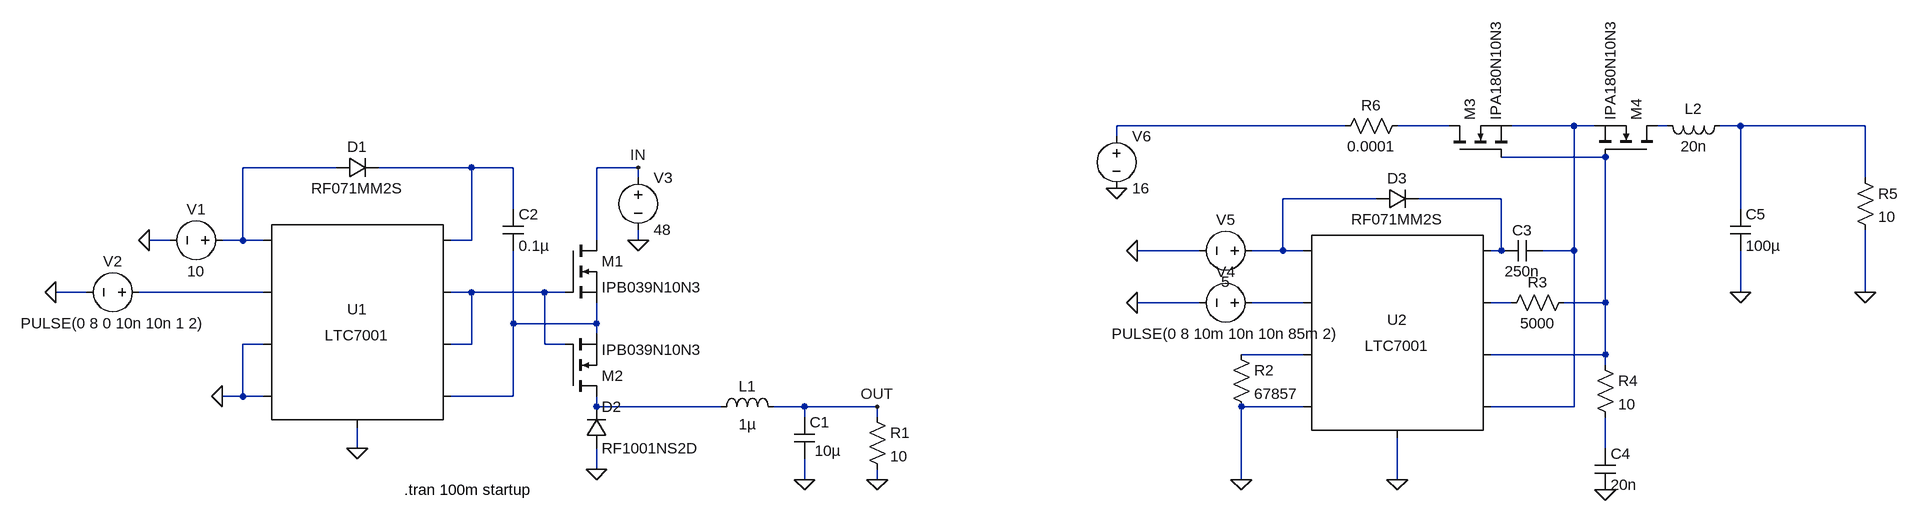
[diagram p0: schematic LTC7001 TEST.asc]
LTC7001 TEST.asc, the LTspice schematic file:
Version 4.1
SHEET 1 3940 1256
WIRE 2672 -352 2320 -352
WIRE 2832 -352 2752 -352
WIRE 3024 -352 2928 -352
WIRE 3056 -352 3024 -352
WIRE 3168 -352 3152 -352
WIRE 3280 -352 3248 -352
WIRE 3472 -352 3280 -352
WIRE 2320 -336 2320 -352
WIRE 3072 -304 2912 -304
WIRE 1120 -288 976 -288
WIRE 1328 -288 1184 -288
WIRE 1392 -288 1328 -288
WIRE 1584 -288 1520 -288
WIRE 1584 -272 1584 -288
WIRE 3472 -272 3472 -352
WIRE 2720 -240 2576 -240
WIRE 2912 -240 2784 -240
WIRE 1392 -224 1392 -288
WIRE 3280 -224 3280 -352
WIRE 864 -176 832 -176
WIRE 976 -176 976 -288
WIRE 976 -176 944 -176
WIRE 1008 -176 976 -176
WIRE 1328 -176 1328 -288
WIRE 1328 -176 1296 -176
WIRE 1520 -176 1520 -288
WIRE 1584 -176 1584 -192
WIRE 2448 -160 2352 -160
WIRE 2576 -160 2576 -240
WIRE 2576 -160 2528 -160
WIRE 2608 -160 2576 -160
WIRE 2912 -160 2912 -240
WIRE 2912 -160 2896 -160
WIRE 3024 -160 3024 -352
WIRE 3024 -160 2976 -160
WIRE 736 -96 688 -96
WIRE 1008 -96 816 -96
WIRE 1328 -96 1296 -96
WIRE 1440 -96 1328 -96
WIRE 1472 -96 1440 -96
WIRE 3280 -96 3280 -160
WIRE 3472 -96 3472 -192
WIRE 2448 -80 2352 -80
WIRE 2608 -80 2528 -80
WIRE 2928 -80 2896 -80
WIRE 3072 -80 3072 -304
WIRE 3072 -80 3008 -80
WIRE 1392 -48 1392 -160
WIRE 1520 -48 1520 -80
WIRE 1520 -48 1392 -48
WIRE 1520 -32 1520 -48
WIRE 1008 -16 976 -16
WIRE 1328 -16 1328 -96
WIRE 1328 -16 1296 -16
WIRE 1440 -16 1440 -96
WIRE 1472 -16 1440 -16
WIRE 2608 0 2512 0
WIRE 3072 0 3072 -80
WIRE 3072 0 2896 0
WIRE 3072 16 3072 0
WIRE 976 64 976 -16
WIRE 976 64 944 64
WIRE 1008 64 976 64
WIRE 1392 64 1392 -48
WIRE 1392 64 1296 64
WIRE 1520 80 1520 64
WIRE 1712 80 1520 80
WIRE 1840 80 1792 80
WIRE 1952 80 1840 80
WIRE 2608 80 2512 80
WIRE 3024 80 3024 -160
WIRE 3024 80 2896 80
WIRE 1840 96 1840 80
WIRE 1952 96 1952 80
WIRE 1152 144 1152 112
WIRE 3072 144 3072 96
WIRE 1520 176 1520 144
WIRE 1840 192 1840 160
WIRE 1952 192 1952 176
WIRE 2512 192 2512 80
WIRE 2752 192 2752 128
FLAG 944 64 0
FLAG 832 -176 0
FLAG 688 -96 0
FLAG 1584 -176 0
FLAG 1840 192 0
FLAG 1952 192 0
FLAG 1952 80 OUT
FLAG 1520 176 0
FLAG 1152 144 0
FLAG 1584 -288 IN
FLAG 2752 192 0
FLAG 2512 192 0
FLAG 2352 -160 0
FLAG 2352 -80 0
FLAG 3280 -96 0
FLAG 3472 -96 0
FLAG 2320 -256 0
FLAG 3072 208 0
SYMBOL voltage 960 -176 R90
WINDOW 0 -32 56 VBottom 2
WINDOW 3 32 56 VTop 2
SYMATTR InstName V1
SYMATTR Value 10
SYMBOL voltage 832 -96 R90
WINDOW 123 74 56 VTop 2
WINDOW 39 53 56 VTop 2
WINDOW 0 -32 56 VBottom 2
WINDOW 3 32 56 VTop 2
SYMATTR InstName V2
SYMATTR Value PULSE(0 8 0 10n 10n 1 2)
SYMBOL diode 1120 -272 R270
WINDOW 0 32 32 VTop 2
WINDOW 3 0 32 VBottom 2
SYMATTR InstName D1
SYMATTR Value RF071MM2S
SYMBOL nmos 1472 -176 R0
SYMATTR InstName M1
SYMATTR Value IPB039N10N3
SYMBOL ind 1696 96 R270
WINDOW 0 32 56 VTop 2
WINDOW 3 5 56 VBottom 2
SYMATTR InstName L1
SYMATTR Value 1µ
SYMATTR SpiceLine Rser=3m
SYMBOL cap 1824 96 R0
WINDOW 3 32 52 Left 2
SYMATTR Value 10µ
SYMATTR SpiceLine Rser=7m
SYMATTR InstName C1
SYMBOL res 1936 80 R0
SYMATTR InstName R1
SYMATTR Value 10
SYMBOL voltage 1584 -288 R0
SYMATTR InstName V3
SYMATTR Value 48
SYMBOL cap 1376 -224 R0
SYMATTR InstName C2
SYMATTR Value 0.1µ
SYMBOL diode 1504 144 M180
WINDOW 0 24 64 Left 2
WINDOW 3 24 0 Left 2
SYMATTR InstName D2
SYMATTR Value RF1001NS2D
SYMBOL LTC7001 1152 -48 R0
SYMATTR InstName U1
SYMBOL nmos 1472 64 M180
SYMATTR InstName M2
SYMATTR Value IPB039N10N3
SYMBOL PowerProducts\\LTC7001 2752 -32 R0
SYMATTR InstName U2
SYMBOL res 2496 -16 R0
SYMATTR InstName R2
SYMATTR Value 67857
SYMBOL cap 2976 -176 R90
WINDOW 0 0 32 VBottom 2
WINDOW 3 32 32 VTop 2
SYMATTR InstName C3
SYMATTR Value 250n
SYMBOL nmos 2832 -304 R270
SYMATTR InstName M3
SYMATTR Value IPA180N10N3
SYMBOL nmos 3152 -304 M270
SYMATTR InstName M4
SYMATTR Value IPA180N10N3
SYMBOL diode 2720 -224 R270
WINDOW 0 32 32 VTop 2
WINDOW 3 0 32 VBottom 2
SYMATTR InstName D3
SYMATTR Value RF071MM2S
SYMBOL voltage 2544 -80 R90
WINDOW 123 74 56 VTop 2
WINDOW 39 53 56 VTop 2
WINDOW 0 -32 56 VBottom 2
WINDOW 3 32 56 VTop 2
SYMATTR InstName V4
SYMATTR Value PULSE(0 8 10m 10n 10n 85m 2)
SYMBOL voltage 2544 -160 R90
WINDOW 0 -32 56 VBottom 2
WINDOW 3 32 56 VTop 2
WINDOW 123 0 0 Left 0
WINDOW 39 0 0 Left 0
SYMATTR InstName V5
SYMATTR Value 5
SYMBOL cap 3264 -224 R0
SYMATTR InstName C5
SYMATTR Value 100µ
SYMBOL res 3456 -288 R0
SYMATTR InstName R5
SYMATTR Value 10
SYMBOL voltage 2320 -352 R0
WINDOW 123 0 0 Left 0
WINDOW 39 0 0 Left 0
SYMATTR InstName V6
SYMATTR Value 16
SYMBOL res 3024 -96 R90
WINDOW 0 0 56 VBottom 2
WINDOW 3 32 56 VTop 2
SYMATTR InstName R3
SYMATTR Value 5000
SYMBOL cap 3056 144 R0
SYMATTR InstName C4
SYMATTR Value 20n
SYMBOL res 3056 0 R0
SYMATTR InstName R4
SYMATTR Value 10
SYMBOL res 2768 -368 R90
WINDOW 0 0 56 VBottom 2
WINDOW 3 32 56 VTop 2
SYMATTR InstName R6
SYMATTR Value 0.0001
SYMBOL ind 3264 -368 R90
WINDOW 0 5 56 VBottom 2
WINDOW 3 32 56 VTop 2
SYMATTR InstName L2
SYMATTR Value 20n
TEXT 1224 208 Left 2 !.tran 100m startup

The netlist it stands for:
* LTC7001 TEST.asc
V1 N007 0 10
V2 N011 0 PULSE(0 8 0 10n 10n 1 2)
D1 N007 N008 RF071MM2S
M1 IN N012 N015 N015 IPB039N10N3
L1 N017 OUT 1µ Rser=3m
C1 OUT 0 10µ Rser=7m
R1 OUT 0 10
V3 IN 0 48
C2 N008 N015 0.1µ
D2 0 N017 RF1001NS2D
X§U1 N007 0 0 N011 0 N012 N012 N015 N008 LTC7001
M2 N017 N012 N015 N015 IPB039N10N3
X§U2 N009 N016 0 N013 0 N006 N014 N003 N010 LTC7001
R2 N016 0 67857
C3 N003 N010 250n
M3 N002 N006 N003 N003 IPA180N10N3
M4 N004 N006 N003 N003 IPA180N10N3
D3 N009 N010 RF071MM2S
V4 N013 0 PULSE(0 8 10m 10n 10n 85m 2)
V5 N009 0 5
C5 N005 0 100µ
R5 N005 0 10
V6 N001 0 16
R3 N006 N014 5000
C4 N018 0 20n
R4 N006 N018 10
R6 N002 N001 0.0001
L2 N005 N004 20n
.model D D
.lib standard.dio
.model NMOS NMOS
.model PMOS PMOS
.lib standard.mos
.tran 100m startup
.lib LTC7001.sub
.backanno
.end